# EAGLE schematic Magic CAN Node (EAGLE 5.12)
BOARDNAME: Magic CAN Node; BOM: EXCLUDE; DATABASE: ../../../Component libraries/partsdb.txt; PARTNO: 2206SA-10-46; RELEASE: RELEASE; REVISIONDATE: v2.1.0 - 2015-04-07

## Sheet 1 of 7
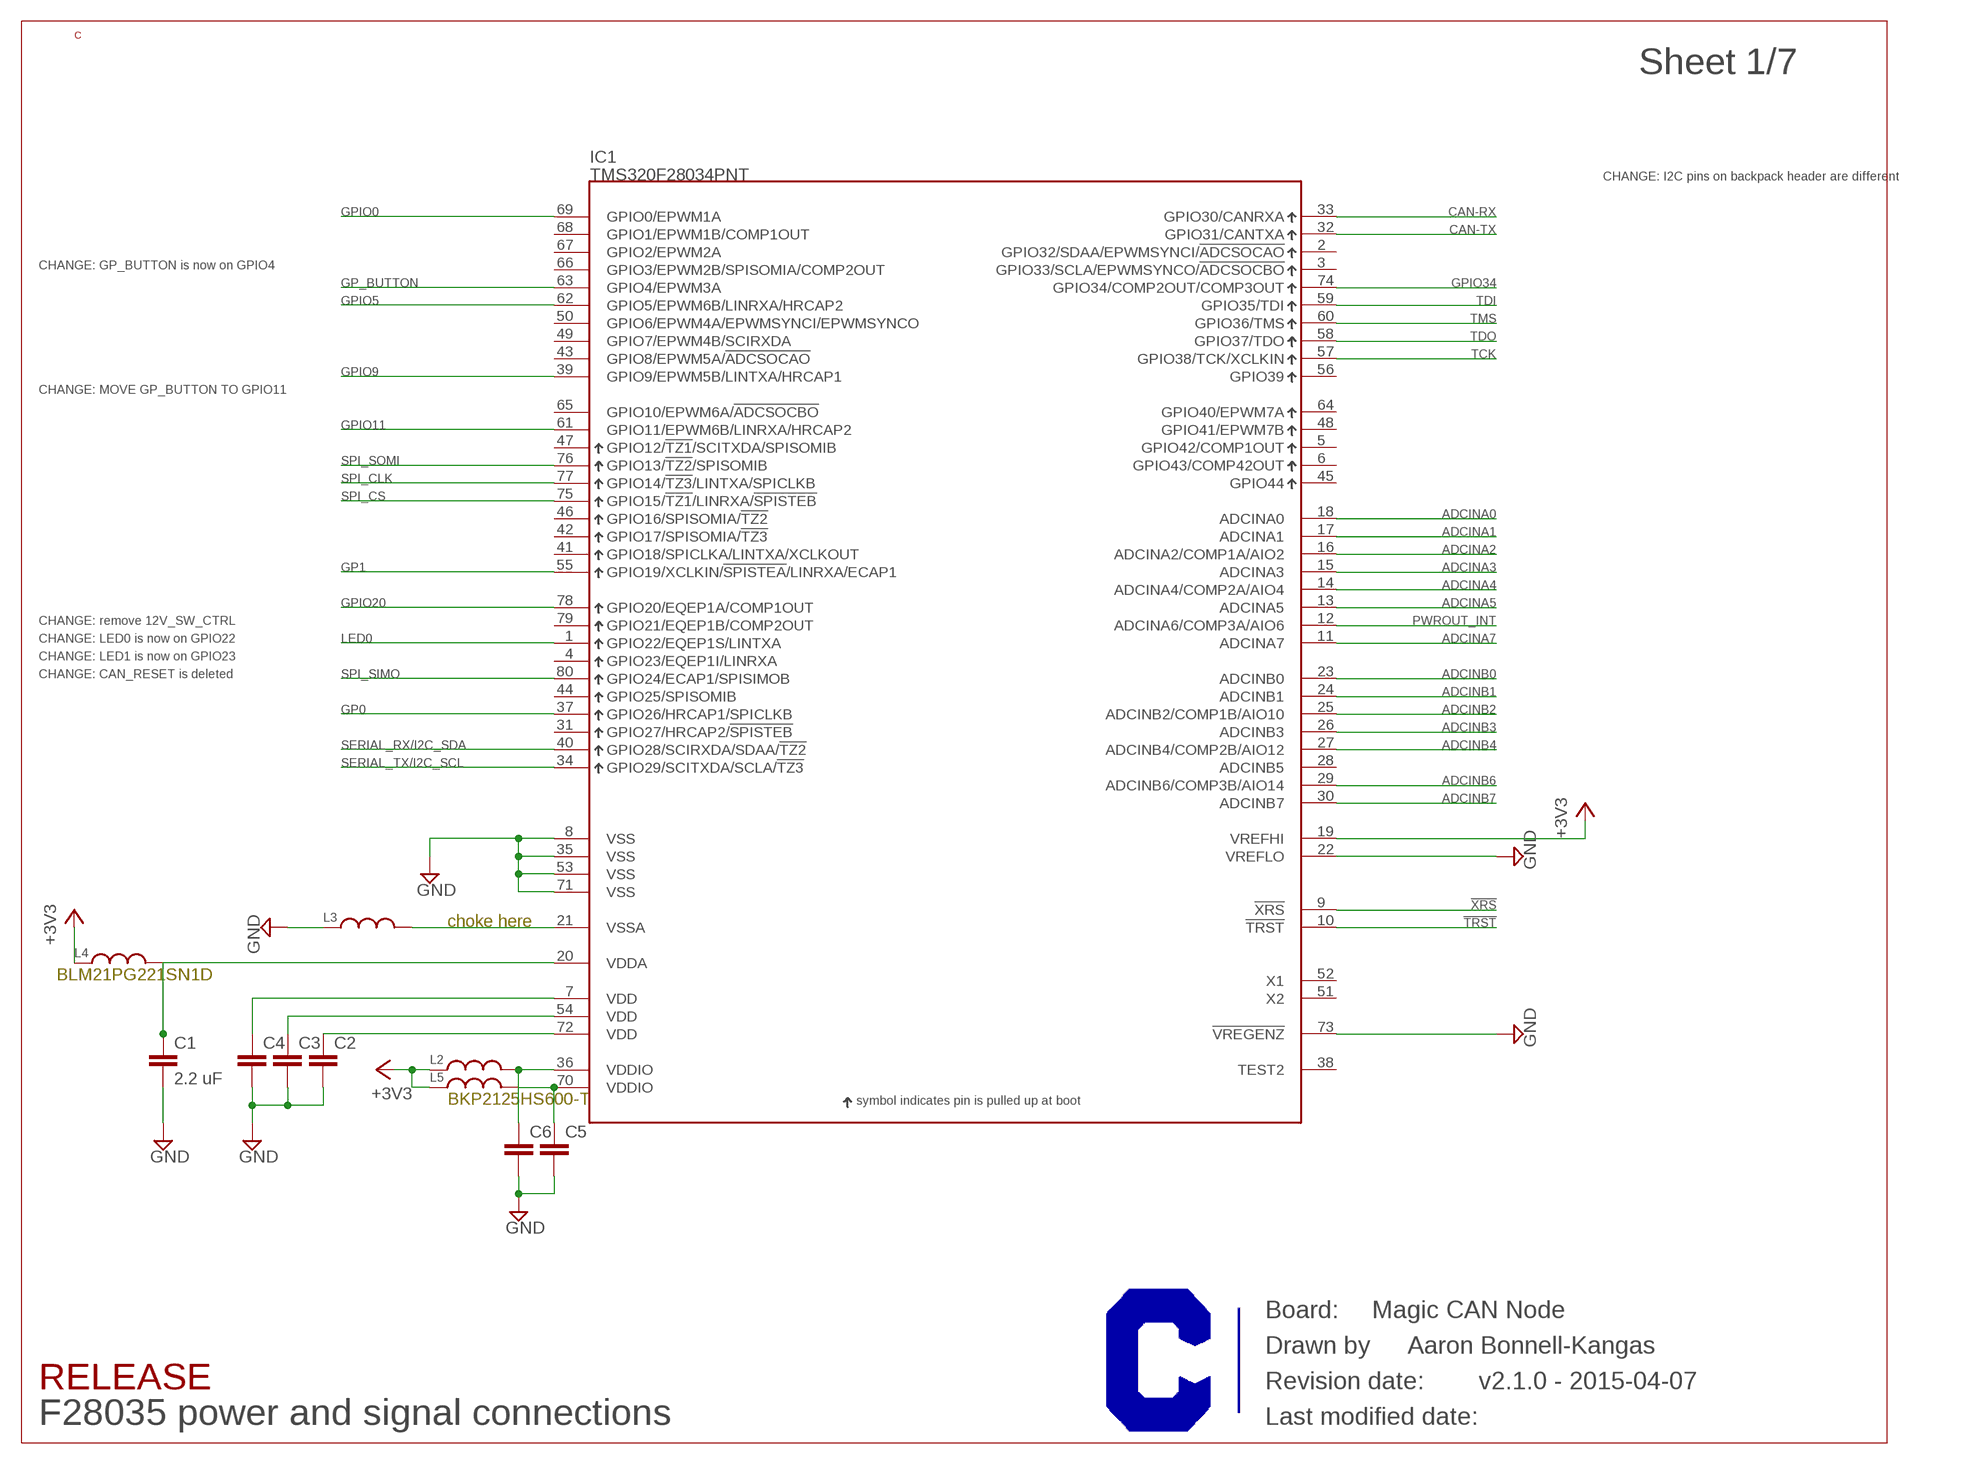
[diagram p0: schematic, sheet 1]

### Parts
C1  2.2 uF  C-EUC0603  [C0603]
C2  2.2 uF  C-EUC0603  [C0603]
C3  2.2 uF  C-EUC0603  [C0603]
C4  2.2 uF  C-EUC0603  [C0603]
C5  2.2 uF  C-EUC0603  [C0603]
C6  2.2 uF  C-EUC0603  [C0603]
IC1  TMS320F28034PNT  [PQFP-80_(S-PQFP-G80)]
L2  INDUCTOR  [0603]
L3  INDUCTOR  [0603]
L4  INDUCTOR  [0603]
L5  INDUCTOR  [0603]
U$2  CURRENT-C-LETTER-LANDSCAPE  [BLANK]
U$11  CURRENT-LOGO-0.25"  [CURRENT-0.25"]

### Nets
!TRST: IC1.10(!TRST) ; also sheet 2
!XRS: IC1.9(!XRS)
+3V3: IC1.19(VREFHI) L2.A L4.A L5.A ; also sheet 2,3,5,6,7
ADCINA0: IC1.18(ADCINA0) ; also sheet 6
ADCINA1: IC1.17(ADCINA1) ; also sheet 6
ADCINA2: IC1.16(ADCINA2/COMP1A/AIO2)
ADCINA3: IC1.15(ADCINA3) ; also sheet 6
ADCINA4: IC1.14(ADCINA4/COMP2A/AIO4) ; also sheet 6
ADCINA5: IC1.13(ADCINA5) ; also sheet 6
ADCINA7: IC1.11(ADCINA7) ; also sheet 6
ADCINB0: IC1.23(ADCINB0) ; also sheet 6
ADCINB1: IC1.24(ADCINB1) ; also sheet 6
ADCINB2: IC1.25(ADCINB2/COMP1B/AIO10) ; also sheet 6
ADCINB3: IC1.26(ADCINB3) ; also sheet 6
ADCINB4: IC1.27(ADCINB4/COMP2B/AIO12) ; also sheet 6
ADCINB6: IC1.29(ADCINB6/COMP3B/AIO14) ; also sheet 6
ADCINB7: IC1.30(ADCINB7) ; also sheet 7
CAN-RX: IC1.33(GPIO30/CANRXA) ; also sheet 4
CAN-TX: IC1.32(GPIO31/CANTXA) ; also sheet 4,5
GND: C1.2 C2.2 C3.2 C4.2 C5.2 C6.2 IC1.8(VSS) IC1.22(VREFLO) IC1.35(VSS) IC1.53(VSS) IC1.71(VSS) IC1.73(!VREGENZ) L3.A ; also sheet 2,3,4,5,6,7
GP0: IC1.37(GPIO26/HRCAP1/SPICLKB) ; also sheet 2
GP1: IC1.55(GPIO19/XCLKIN/!SPISTEA!/LINRXA/ECAP1) ; also sheet 2
GP_BUTTON: IC1.63(GPIO4/EPWM3A) ; also sheet 5
GPIO0: IC1.69(GPIO0/EPWM1A) ; also sheet 7
GPIO5: IC1.62(GPIO5/EPWM6B/LINRXA/HRCAP2) ; also sheet 7
GPIO9: IC1.39(GPIO9/EPWM5B/LINTXA/HRCAP1) ; also sheet 7
GPIO11: IC1.61(GPIO11/EPWM6B/LINRXA/HRCAP2) ; also sheet 7
GPIO20: IC1.78(GPIO20/EQEP1A/COMP1OUT) ; also sheet 7
GPIO34: IC1.74(GPIO34/COMP2OUT/COMP3OUT) ; also sheet 2
LED0: IC1.1(GPIO22/EQEP1S/LINTXA) ; also sheet 5
N$10: IC1.21(VSSA) L3.B
N$11: C6.1 IC1.36(VDDIO) L2.B
N$12: C5.1 IC1.70(VDDIO) L5.B
PWROUT_INT: IC1.12(ADCINA6/COMP3A/AIO6) ; also sheet 3
SERIAL_RX/I2C_SDA: IC1.40(GPIO28/SCIRXDA/SDAA/!TZ2) ; also sheet 7
SERIAL_TX/I2C_SCL: IC1.34(GPIO29/SCITXDA/SCLA/!TZ3) ; also sheet 7
SPI_CLK: IC1.77(GPIO14/!TZ3!/LINTXA/SPICLKB) ; also sheet 7
SPI_CS: IC1.75(GPIO15/!TZ1!/LINRXA/!SPISTEB) ; also sheet 7
SPI_SIMO: IC1.80(GPIO24/ECAP1/SPISIMOB) ; also sheet 7
SPI_SOMI: IC1.76(GPIO13/!TZ2!/SPISOMIB) ; also sheet 7
TCK: IC1.57(GPIO38/TCK/XCLKIN) ; also sheet 2
TDI: IC1.59(GPIO35/TDI) ; also sheet 2
TDO: IC1.58(GPIO37/TDO) ; also sheet 2
TMS: IC1.60(GPIO36/TMS) ; also sheet 2
VDD1: C2.1 IC1.72(VDD)
VDD2: C3.1 IC1.54(VDD)
VDD3: C4.1 IC1.7(VDD)
VDDA: C1.1 IC1.20(VDDA) L4.B
Unconnected: IC1.2(GPIO32/SDAA/EPWMSYNCI/!ADCSOCAO) IC1.3(GPIO33/SCLA/EPWMSYNCO/!ADCSOCBO) IC1.4(GPIO23/EQEP1I/LINRXA) IC1.5(GPIO42/COMP1OUT) IC1.6(GPIO43/COMP42OUT) IC1.28(ADCINB5) IC1.31(GPIO27/HRCAP2/!SPISTEB) IC1.38(TEST2) IC1.41(GPIO18/SPICLKA/LINTXA/XCLKOUT) IC1.42(GPIO17/SPISOMIA/!TZ3) IC1.43(GPIO8/EPWM5A/!ADCSOCAO) IC1.44(GPIO25/SPISOMIB) IC1.45(GPIO44) IC1.46(GPIO16/SPISOMIA/!TZ2) IC1.47(GPIO12/!TZ1!/SCITXDA/SPISOMIB) IC1.48(GPIO41/EPWM7B) IC1.49(GPIO7/EPWM4B/SCIRXDA) IC1.50(GPIO6/EPWM4A/EPWMSYNCI/EPWMSYNCO) IC1.51(X2) IC1.52(X1) IC1.56(GPIO39) IC1.64(GPIO40/EPWM7A) IC1.65(GPIO10/EPWM6A/!ADCSOCBO) IC1.66(GPIO3/EPWM2B/SPISOMIA/COMP2OUT) IC1.67(GPIO2/EPWM2A) IC1.68(GPIO1/EPWM1B/COMP1OUT) IC1.79(GPIO21/EQEP1B/COMP2OUT)

### Notes on the sheet
- CHANGE: I2C pins on backpack header are different
- CHANGE: GP_BUTTON is now on GPIO4
- CHANGE: MOVE GP_BUTTON TO GPIO11
- CHANGE: remove 12V_SW_CTRL
- CHANGE: LED0 is now on GPIO22
- CHANGE: LED1 is now on GPIO23
- CHANGE: CAN_RESET is deleted
- choke here
- BLM21PG221SN1D
- BKP2125HS600-T
- Aaron Bonnell-Kangas
- F28035 power and signal connections

## Sheet 2 of 7
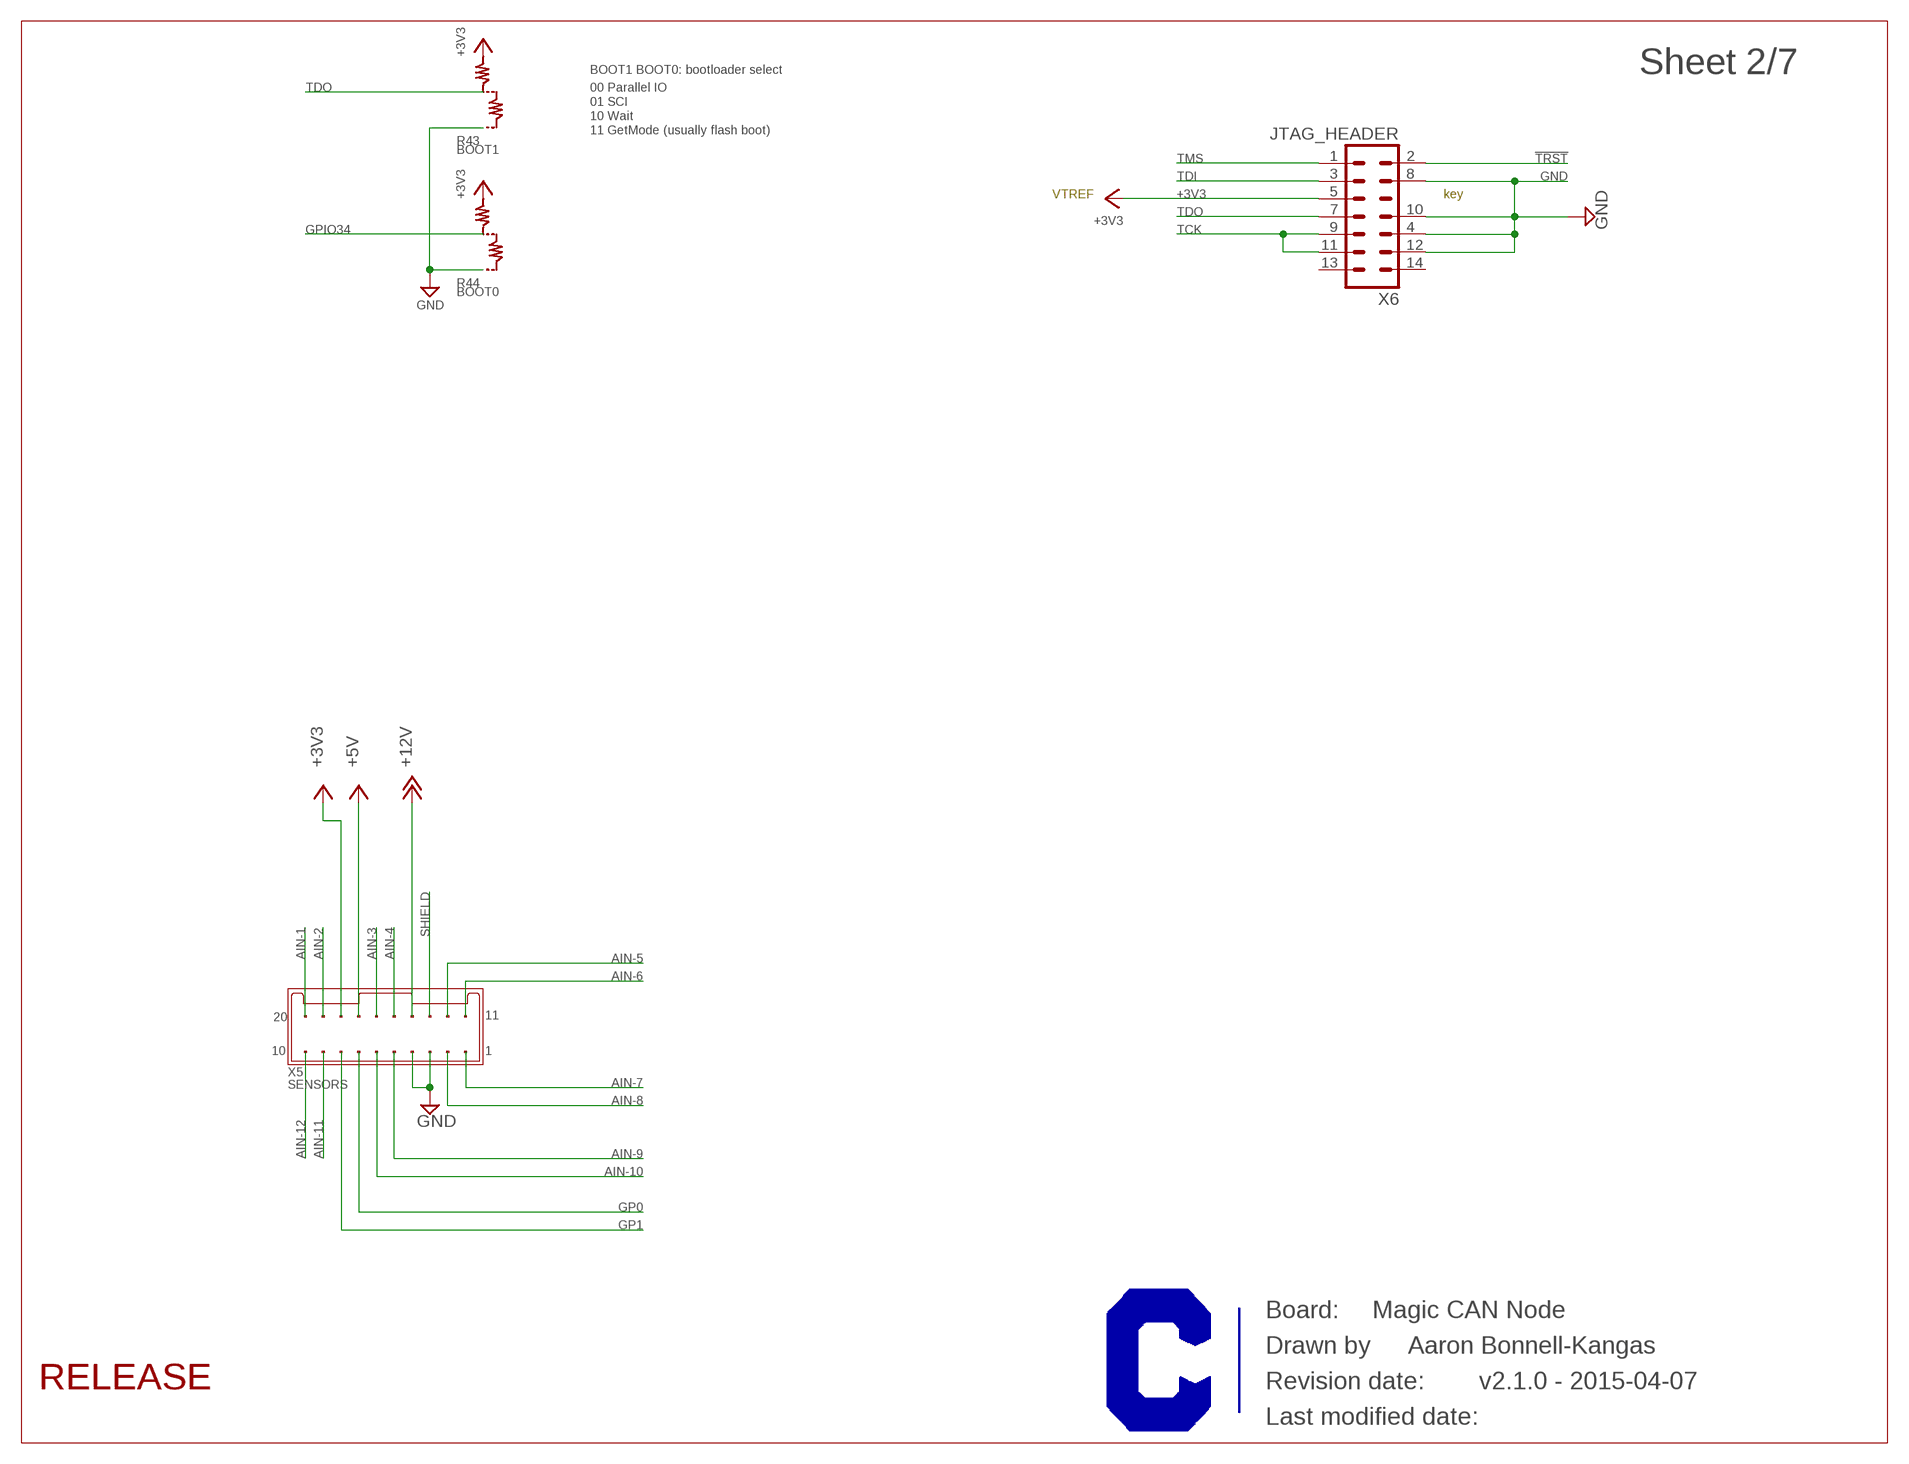
[diagram p1: schematic, sheet 2]

### Parts
R43  BOOT1  0402-JUMPER-3WAY-0603  [0603-JUMPER-3WAY]
R44  BOOT0  0402-JUMPER-3WAY-0603  [0603-JUMPER-3WAY]
U$3  CURRENT-C-LETTER-LANDSCAPE  [BLANK]
X5  SENSORS  MICROCLASP-20-DUAL-RA  [MICROCLASP-20-DUAL-RA]
X6  JTAG_HEADER  JTAG_HEADER-0.05"-SMT-VERT  [TI_JTAG_HEADER_0.05"_SMT]

### Nets
!TRST: X6.2(!TRST) ; also sheet 1
+3V3: R43.B R44.B X5.18 X6.5(VTREF) ; also sheet 1,3,5,6,7
+5V: X5.17 ; also sheet 3,4,7
+12V: X5.14 ; also sheet 3,4,5,7
AIN-1: X5.20 ; also sheet 6
AIN-2: X5.19 ; also sheet 6
AIN-3: X5.16 ; also sheet 6
AIN-4: X5.15 ; also sheet 6
AIN-5: X5.12 ; also sheet 6
AIN-6: X5.11 ; also sheet 6
AIN-7: X5.1 ; also sheet 6
AIN-8: X5.2 ; also sheet 6
AIN-9: X5.5 ; also sheet 6
AIN-10: X5.6 ; also sheet 6
AIN-11: X5.9 ; also sheet 6
AIN-12: X5.10 ; also sheet 6
GND: R43.C R44.C X5.3 X5.4 X6.4(GND) X6.8(GND) X6.10(GND) X6.12(GND) ; also sheet 1,3,4,5,6,7
GP0: X5.7 ; also sheet 1
GP1: X5.8 ; also sheet 1
GPIO34: R44.A ; also sheet 1
SHIELD: X5.13 ; also sheet 4,7
TCK: X6.9(TCK) X6.11 ; also sheet 1
TDI: X6.3(TDI) ; also sheet 1
TDO: R43.A X6.7(TDO) ; also sheet 1
TMS: X6.1(TMS) ; also sheet 1
Unconnected: X6.13(EMU0) X6.14(EMU1)

### Notes on the sheet
- BOOT1 BOOT0: bootloader select
- 00 Parallel IO
- 01 SCI
- 10 Wait
- 11 GetMode (usually flash boot)
- VTREF | key
- Aaron Bonnell-Kangas

## Sheet 3 of 7
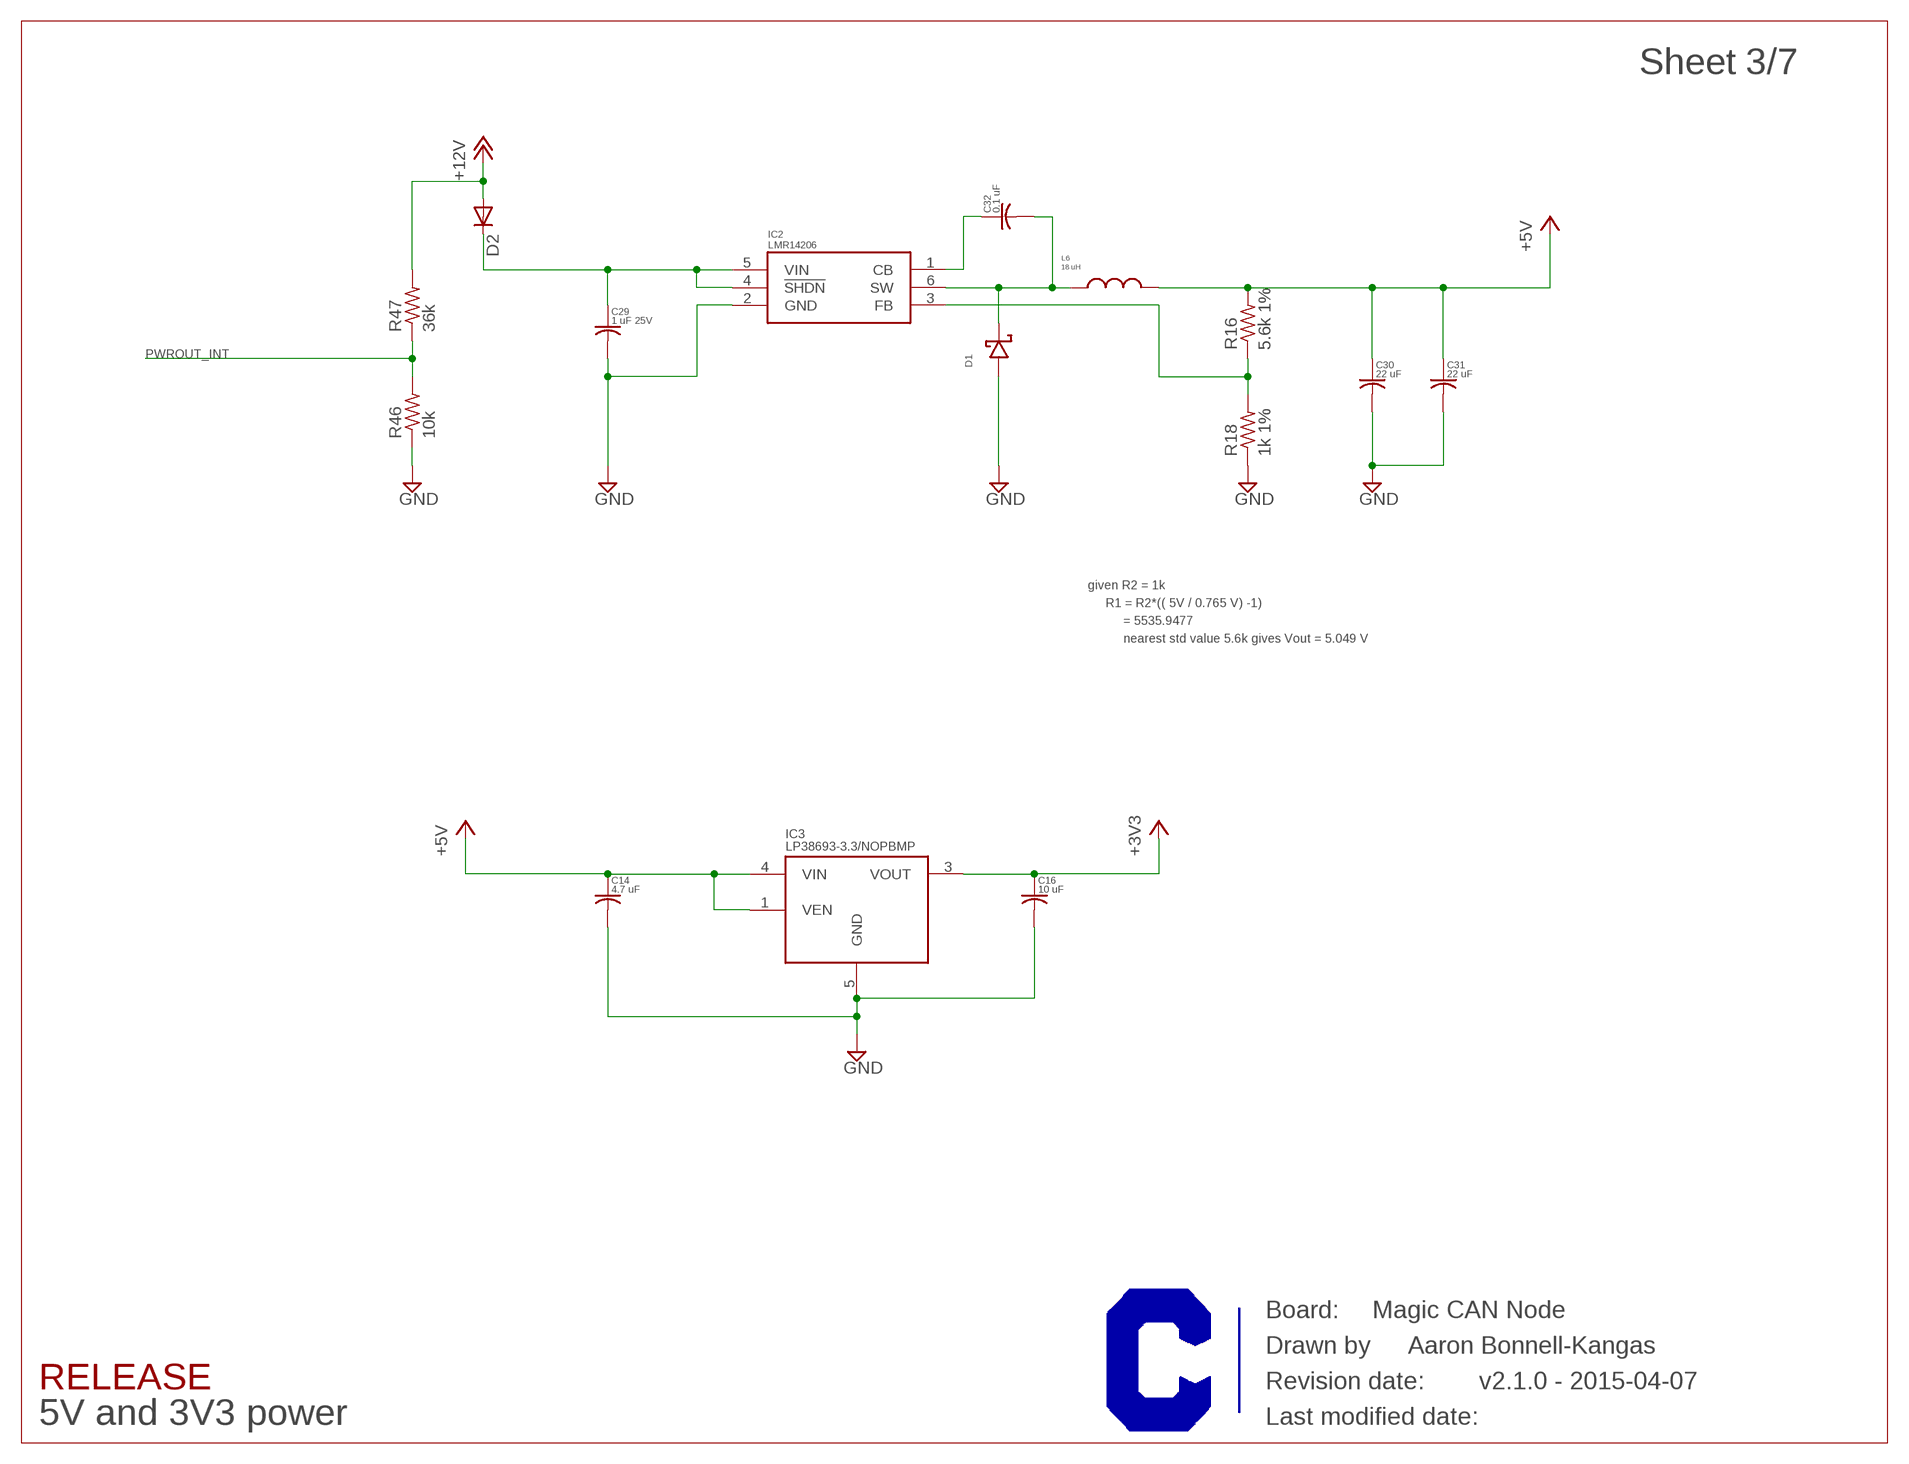
[diagram p2: schematic, sheet 3]

### Parts
C14  4.7 uF  C-USC1206  [C1206]
C16  10 uF  C-USC1206  [C1206]
C29  1 uF 25V  C-USC1206  [C1206]
C30  22 uF  C-USC0805  [C0805]
C31  22 uF  C-USC0805  [C0805]
C32  0.1 uF  C-USC0603  [C0603]
D1  SCHOTTKY_DIODE-SMA  [SMA]
D2  DIODE-SOD123  [SOD123]
IC2  LMR14206  [SOT-6_DDC]
IC3  LP38693-3.3/NOPBMP  [SOT-223-5]
L6  18 uH  VLP8040T  [VLP8040]
R16  5.6k 1%  R-US_R0603  [R0603]
R18  1k 1%  R-US_R0603  [R0603]
R46  10k  R-US_R0603  [R0603]
R47  36k  R-US_R0603  [R0603]
U$6  CURRENT-C-LETTER-LANDSCAPE  [BLANK]

### Nets
+3V3: C16.1 IC3.3(VOUT) ; also sheet 1,2,5,6,7
+5V: C14.1 C30.1 C31.1 IC3.1(VEN) IC3.4(VIN) L6.2 R16.2 ; also sheet 2,4,7
+12V: D2.A R47.2 ; also sheet 2,4,5,7
GND: C14.2 C16.2 C29.2 C30.2 C31.2 D1.ANODE IC2.2(GND) IC3.5(GND) R18.1 R46.1 ; also sheet 1,2,4,5,6,7
N$3: C32.2 D1.CATHODE IC2.6(SW) L6.1
N$7: C32.1 IC2.1(CB)
N$8: C29.1 D2.C IC2.4(!SHDN) IC2.5(VIN)
PWROUT_INT: R46.2 R47.1 ; also sheet 1
VSENSE1: IC2.3(FB) R16.1 R18.2

### Notes on the sheet
- given R2 = 1k
- R1 = R2*(( 5V / 0.765 V) -1)
- = 5535.9477
- nearest std value 5.6k gives Vout = 5.049 V
- Aaron Bonnell-Kangas
- 5V and 3V3 power

## Sheet 4 of 7
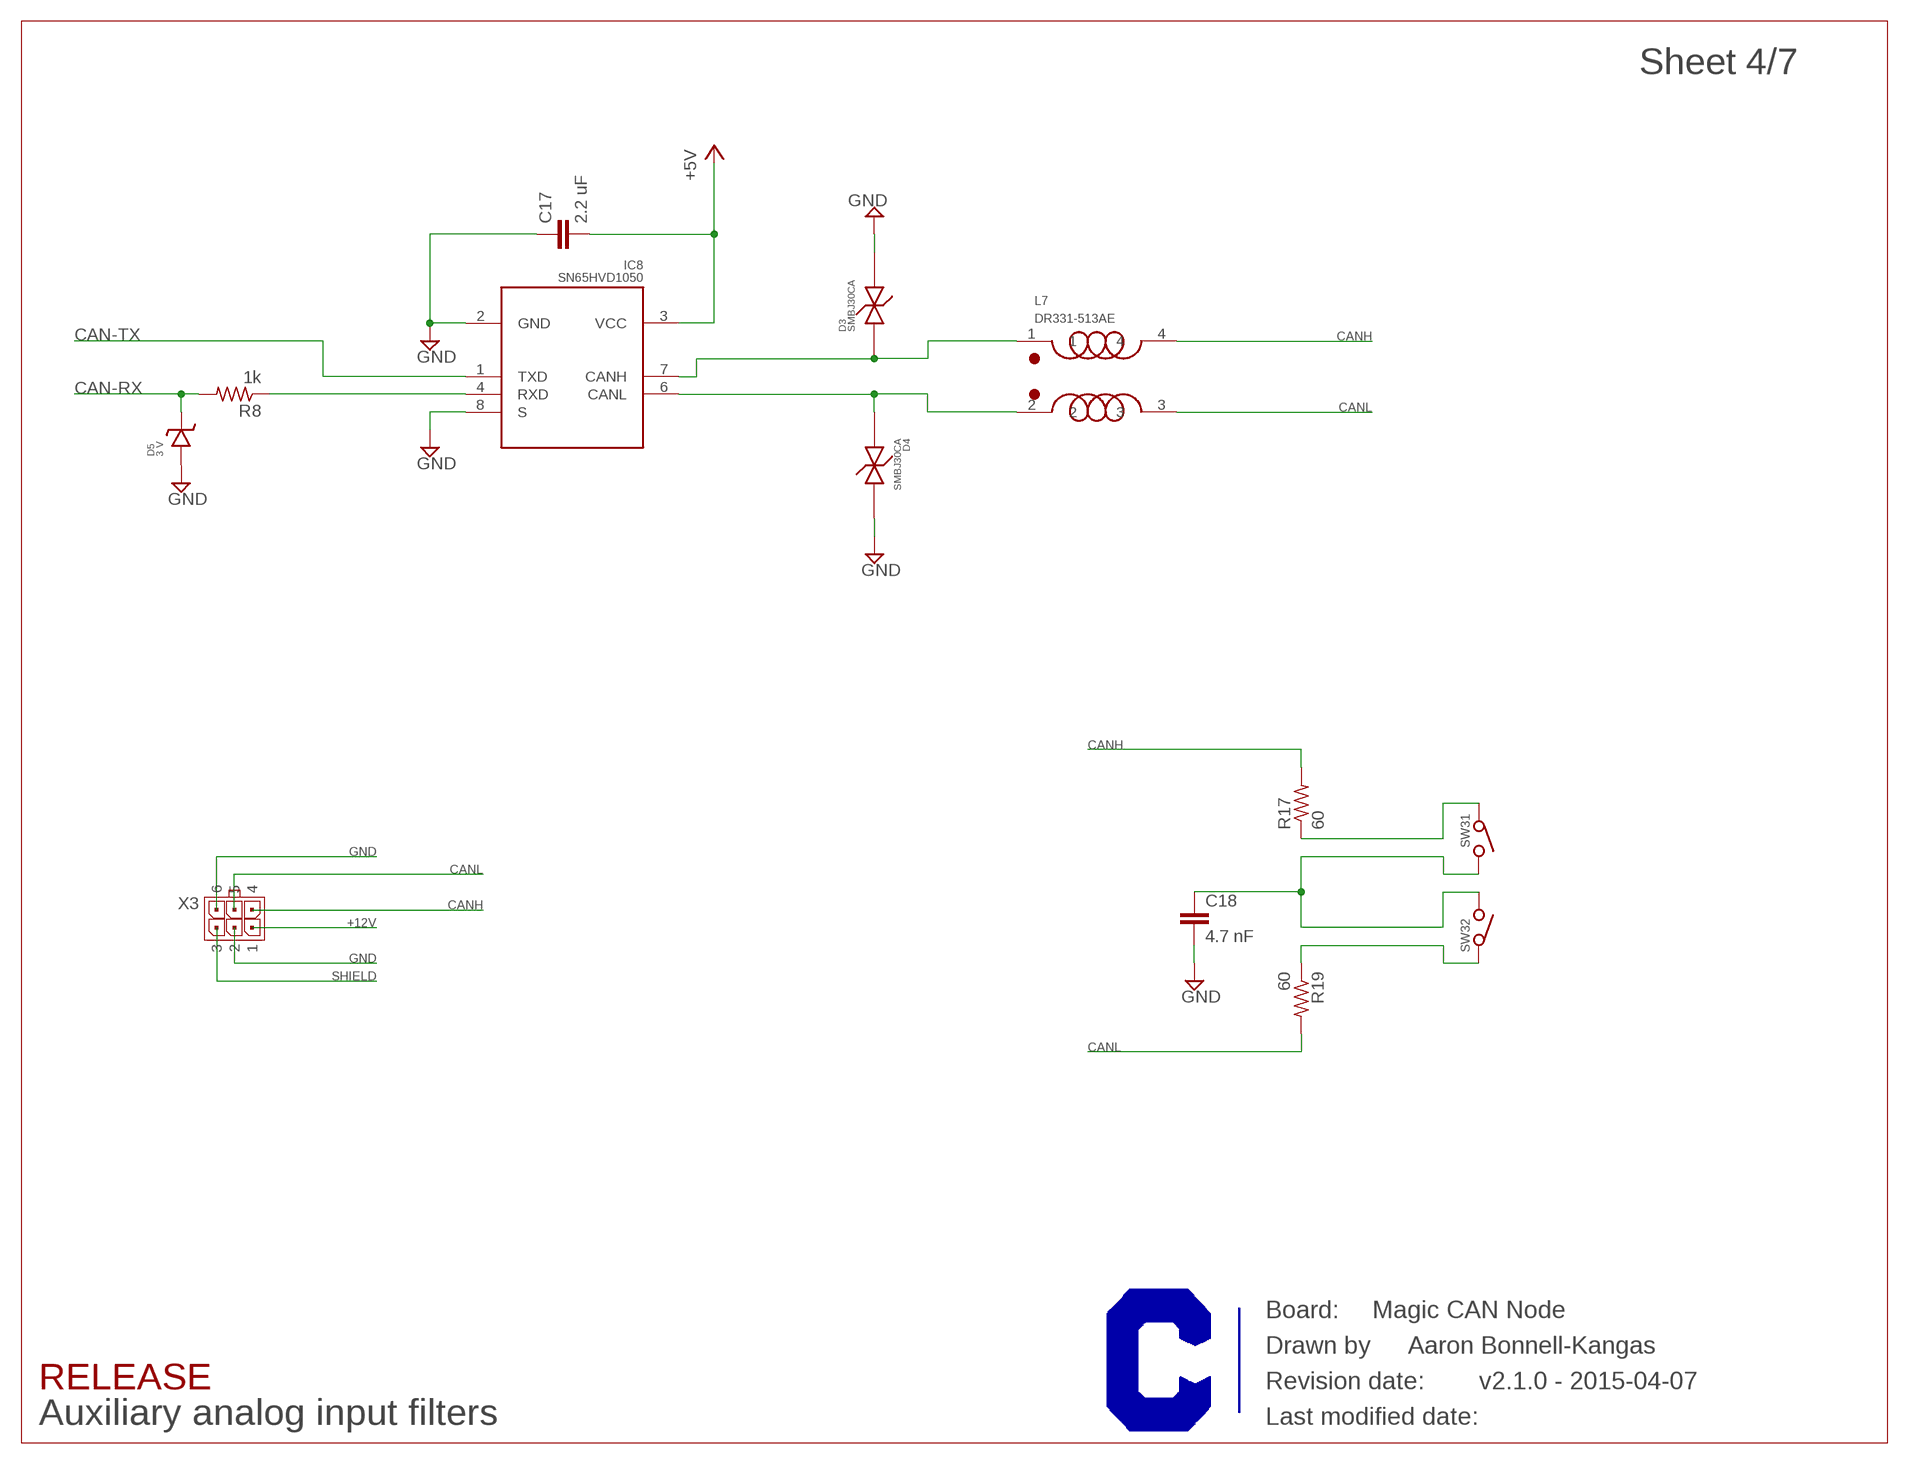
[diagram p3: schematic, sheet 4]

### Parts
C17  2.2 uF  C-EUC0603  [C0603]
C18  4.7 nF  C-EUC0603  [C0603]
D3  SMBJ30CA  [DO-214AA]
D4  SMBJ30CA  [DO-214AA]
D5  3 V  ZENER_DIODE-SOD-323  [SOD-323]
IC8  SN65HVD1050  [D_(R-PDSO-G8)]
L7  DR331-513AE  [SMD]
R8  1k  R-US_R0603  [R0603]
R17  60  R-US_R0603  [R0603]
R19  60  R-US_R0603  [R0603]
SW3  218-2_GULLWING  [218-2_GULLWING]
U$9  CURRENT-C-LETTER-LANDSCAPE  [BLANK]
X3  MICROFIT-06-DUAL-RA-SMD  [MICROFIT-6-DUAL-RA-SMD]

### Nets
+5V: C17.2 IC8.3(VCC) ; also sheet 2,3,7
+12V: X3.1 ; also sheet 2,3,5,7
CAN-RX: D5.CATHODE R8.2 ; also sheet 1
CAN-TX: IC8.1(TXD) ; also sheet 1,5
CANH: L7.4 R17.2 X3.4
CANL: L7.3 R19.2 X3.5
GND: C17.1 C18.2 D3.2 D4.2 D5.ANODE IC8.2(GND) IC8.8(S) X3.2 X3.6 ; also sheet 1,2,3,5,6,7
N$20: D4.1 IC8.6(CANL) L7.2
N$21: D3.1 IC8.7(CANH) L7.1
N$22: R19.1 SW3.2A
N$23: R17.1 SW3.1A
N$24: C18.1 SW3.1B SW3.2B
N$26: IC8.4(RXD) R8.1
SHIELD: X3.3 ; also sheet 2,7

### Notes on the sheet
- Aaron Bonnell-Kangas
- Auxiliary analog input filters

## Sheet 5 of 7
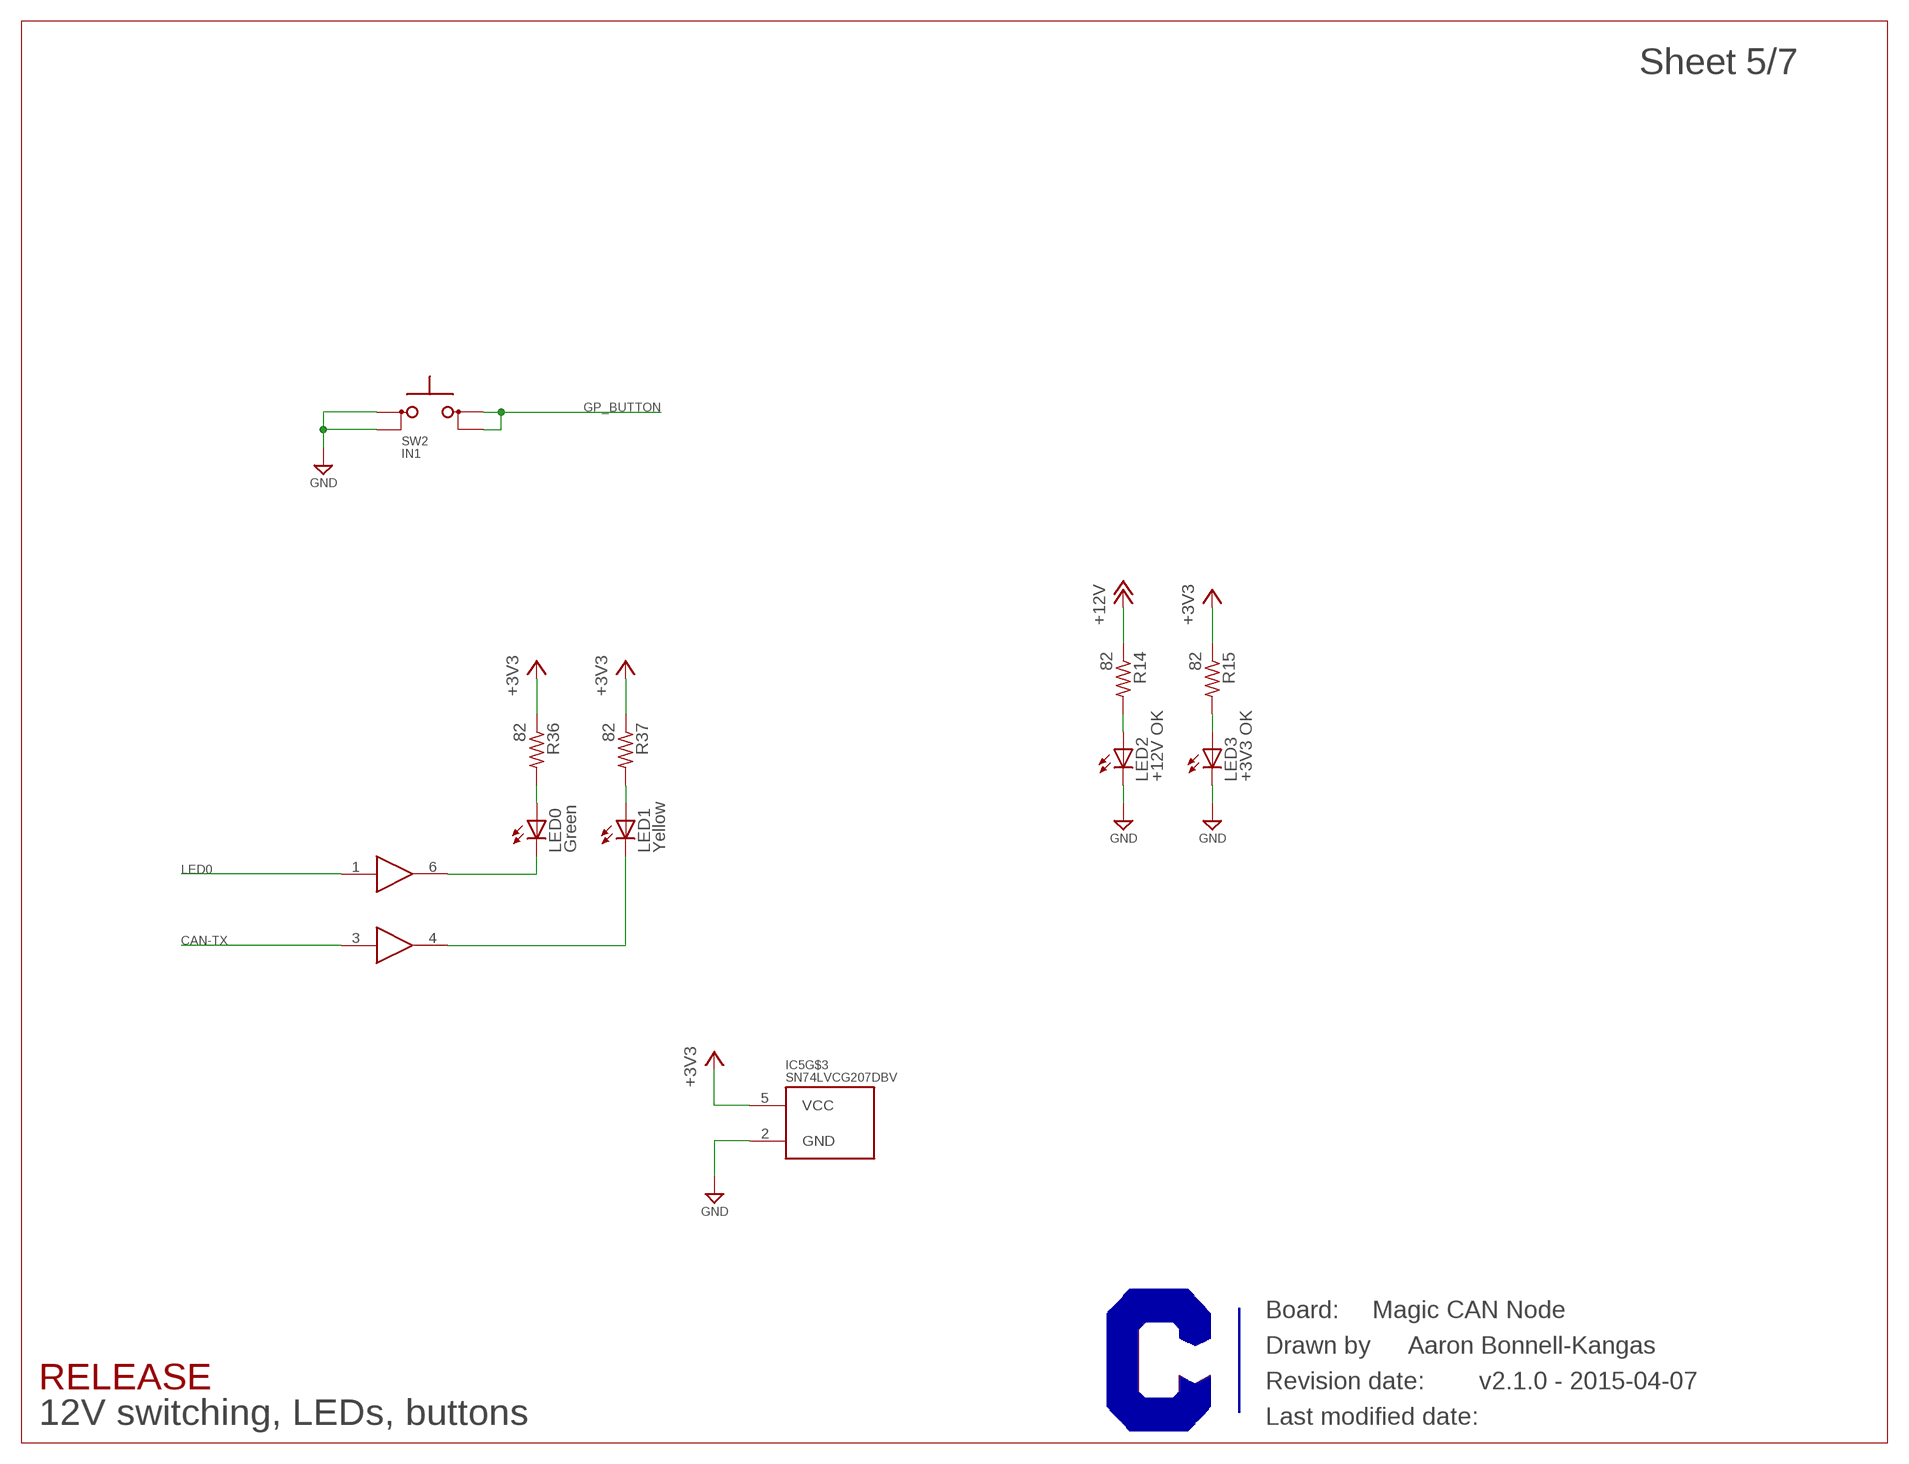
[diagram p4: schematic, sheet 5]

### Parts
IC5  SN74LVCG207DBV  [DBV_(R-PDSO-G6)]
LED0  Green  LEDCHIP-LED0603  [CHIP-LED0603]
LED1  Yellow  LEDCHIP-LED0603  [CHIP-LED0603]
LED2  +12V OK  LEDCHIP-LED0603  [CHIP-LED0603]
LED3  +3V3 OK  LEDCHIP-LED0603  [CHIP-LED0603]
R14  82  R-US_R0805  [R0805]
R15  82  R-US_R0805  [R0805]
R36  82  R-US_R0805  [R0805]
R37  82  R-US_R0805  [R0805]
SW2  IN1  MC32884  [MC32884]
U$1  CURRENT-C-LETTER-LANDSCAPE  [BLANK]

### Nets
+3V3: IC5.5(VCC) R15.1 R36.1 R37.1 ; also sheet 1,2,3,6,7
+12V: R14.1 ; also sheet 2,3,4,7
CAN-TX: IC5.3(A) ; also sheet 1,4
GND: IC5.2(GND) LED2.C LED3.C SW2.A@1(A) SW2.A@2(A) ; also sheet 1,2,3,4,6,7
GP_BUTTON: SW2.B@1(B) SW2.B@2(B) ; also sheet 1
LED0: IC5.1(A) ; also sheet 1
N$1: LED2.A R14.2
N$2: LED3.A R15.2
N$37: IC5.6(Y) LED0.C
N$38: IC5.4(Y) LED1.C
N$39: LED0.A R36.2
N$40: LED1.A R37.2

### Notes on the sheet
- Aaron Bonnell-Kangas
- 12V switching, LEDs, buttons

## Sheet 6 of 7
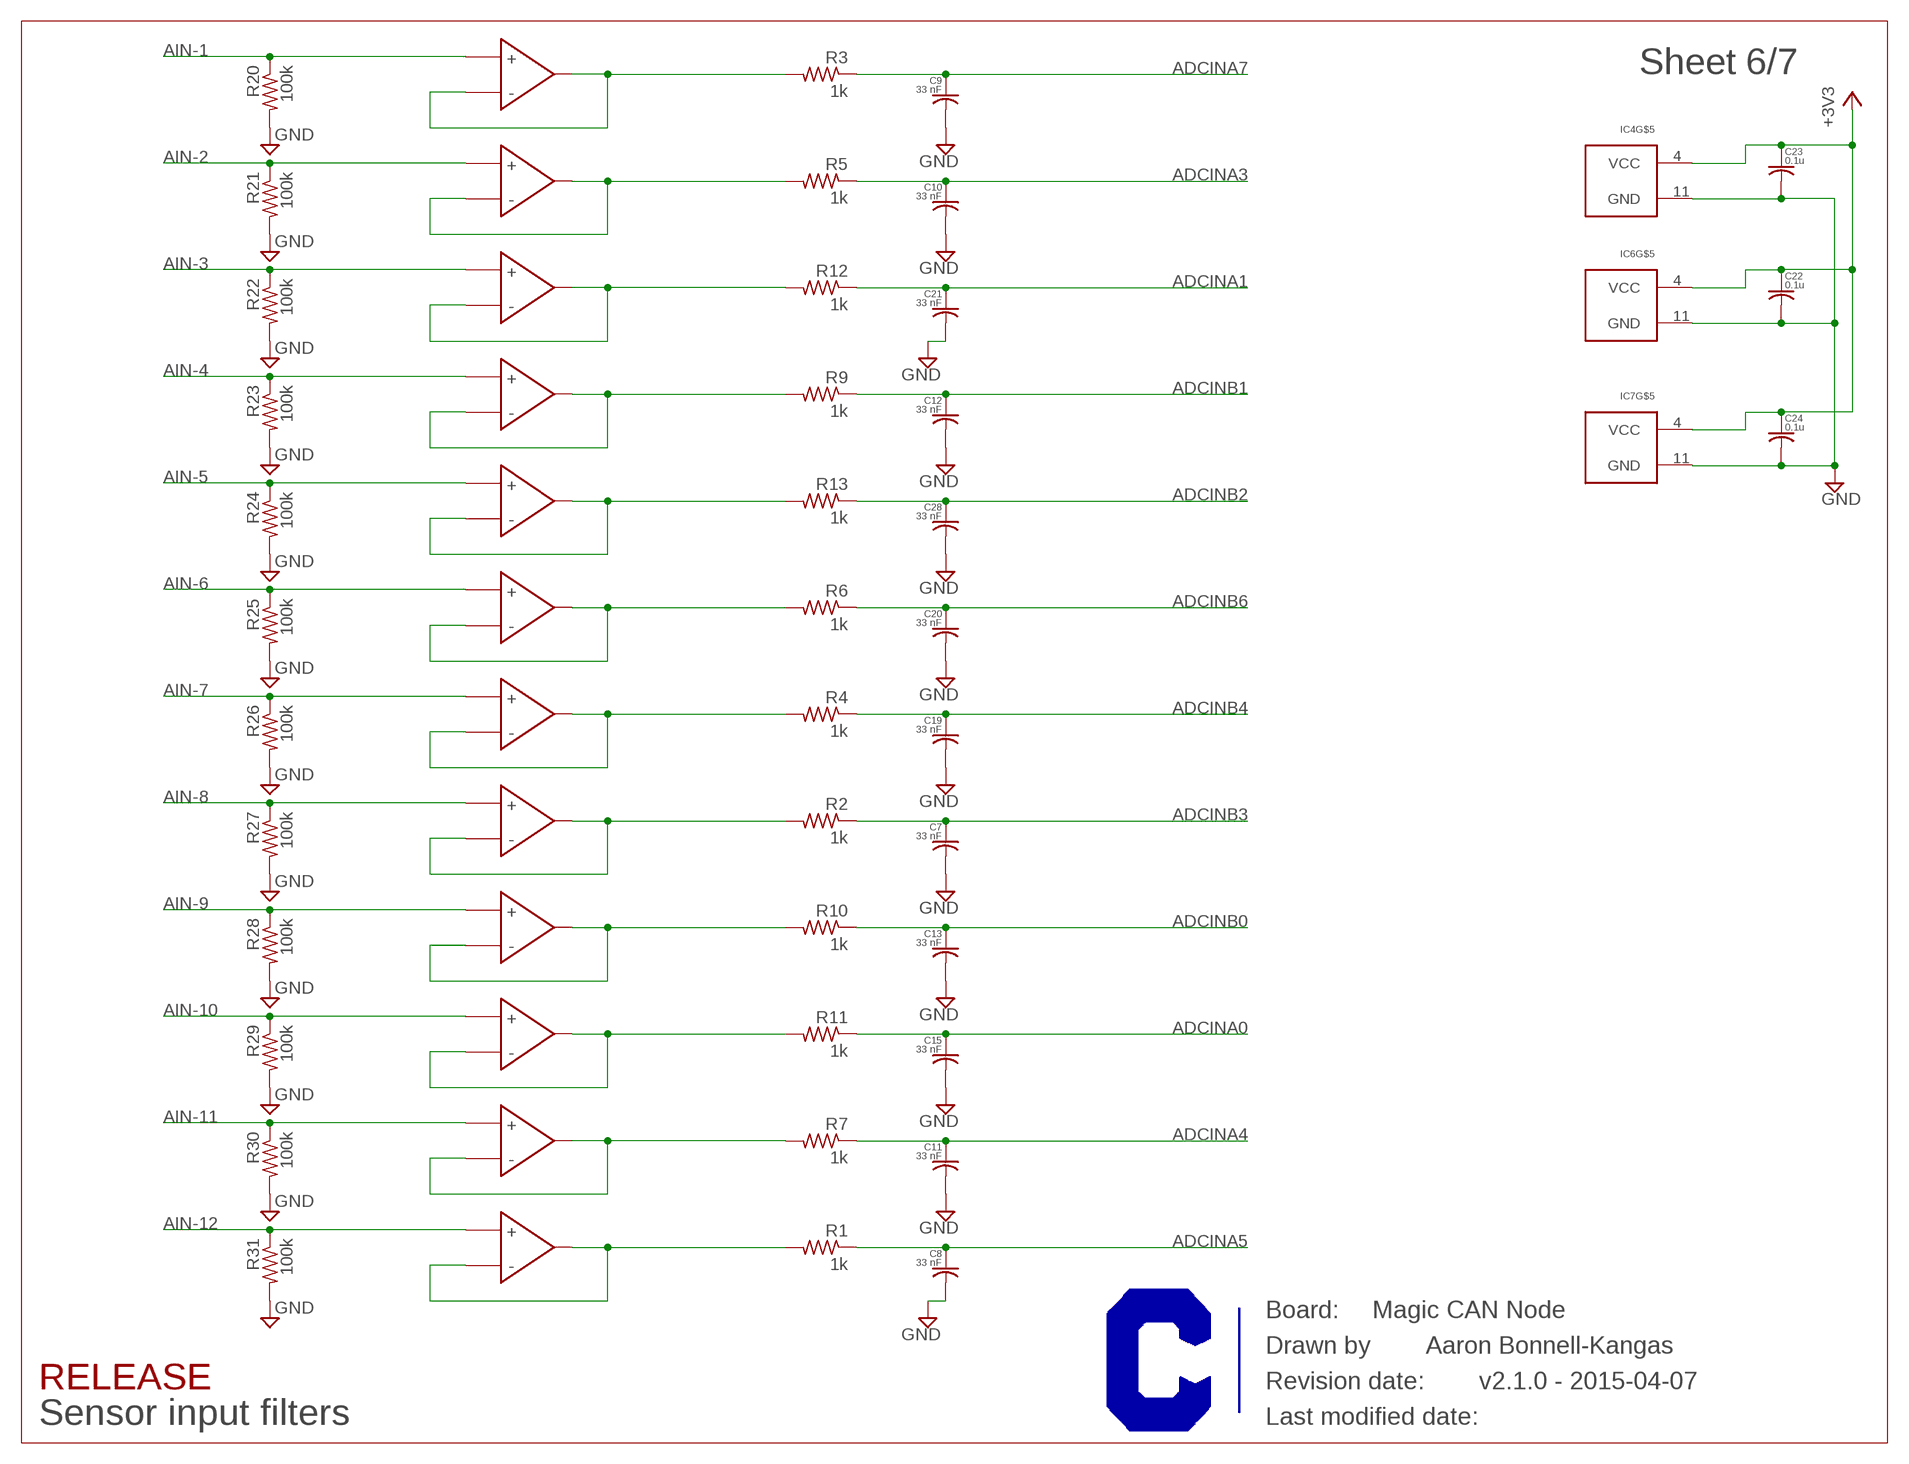
[diagram p5: schematic, sheet 6]

### Parts
C7  33 nF  C-USC0603  [C0603]
C8  33 nF  C-USC0603  [C0603]
C9  33 nF  C-USC0603  [C0603]
C10  33 nF  C-USC0603  [C0603]
C11  33 nF  C-USC0603  [C0603]
C12  33 nF  C-USC0603  [C0603]
C13  33 nF  C-USC0603  [C0603]
C15  33 nF  C-USC0603  [C0603]
C19  33 nF  C-USC0603  [C0603]
C20  33 nF  C-USC0603  [C0603]
C21  33 nF  C-USC0603  [C0603]
C22  0.1u  C-USC0603  [C0603]
C23  0.1u  C-USC0603  [C0603]
C24  0.1u  C-USC0603  [C0603]
C28  33 nF  C-USC0603  [C0603]
IC4  TLV2764IPWR  [PW_(R-PDSO-G14)_(TSSOP-14)]
IC6  TLV2764IPWR  [PW_(R-PDSO-G14)_(TSSOP-14)]
IC7  TLV2764IPWR  [PW_(R-PDSO-G14)_(TSSOP-14)]
R1  1k  R-US_R0603  [R0603]
R2  1k  R-US_R0603  [R0603]
R3  1k  R-US_R0603  [R0603]
R4  1k  R-US_R0603  [R0603]
R5  1k  R-US_R0603  [R0603]
R6  1k  R-US_R0603  [R0603]
R7  1k  R-US_R0603  [R0603]
R9  1k  R-US_R0603  [R0603]
R10  1k  R-US_R0603  [R0603]
R11  1k  R-US_R0603  [R0603]
R12  1k  R-US_R0603  [R0603]
R13  1k  R-US_R0603  [R0603]
R20  100k  R-US_R0402  [R0402]
R21  100k  R-US_R0402  [R0402]
R22  100k  R-US_R0402  [R0402]
R23  100k  R-US_R0402  [R0402]
R24  100k  R-US_R0402  [R0402]
R25  100k  R-US_R0402  [R0402]
R26  100k  R-US_R0402  [R0402]
R27  100k  R-US_R0402  [R0402]
R28  100k  R-US_R0402  [R0402]
R29  100k  R-US_R0402  [R0402]
R30  100k  R-US_R0402  [R0402]
R31  100k  R-US_R0402  [R0402]
U$7  CURRENT-C-LETTER-LANDSCAPE  [BLANK]

### Nets
+3V3: C22.1 C23.1 C24.1 IC4.4(VCC) IC6.4(VCC) IC7.4(VCC) ; also sheet 1,2,3,5,7
ADCINA0: C15.1 R11.1 ; also sheet 1
ADCINA1: C21.1 R12.1 ; also sheet 1
ADCINA3: C10.1 R5.1 ; also sheet 1
ADCINA4: C11.1 R7.1 ; also sheet 1
ADCINA5: C8.1 R1.1 ; also sheet 1
ADCINA7: C9.1 R3.1 ; also sheet 1
ADCINB0: C13.1 R10.1 ; also sheet 1
ADCINB1: C12.1 R9.1 ; also sheet 1
ADCINB2: C28.1 R13.1 ; also sheet 1
ADCINB3: C7.1 R2.1 ; also sheet 1
ADCINB4: C19.1 R4.1 ; also sheet 1
ADCINB6: C20.1 R6.1 ; also sheet 1
AIN-1: IC4.3(IN+) R20.1 ; also sheet 2
AIN-2: IC4.12(IN+) R21.1 ; also sheet 2
AIN-3: IC6.3(IN+) R22.1 ; also sheet 2
AIN-4: IC6.12(IN+) R23.1 ; also sheet 2
AIN-5: IC7.3(IN+) R24.1 ; also sheet 2
AIN-6: IC7.12(IN+) R25.1 ; also sheet 2
AIN-7: IC7.10(IN+) R26.1 ; also sheet 2
AIN-8: IC7.5(IN+) R27.1 ; also sheet 2
AIN-9: IC6.10(IN+) R28.1 ; also sheet 2
AIN-10: IC6.5(IN+) R29.1 ; also sheet 2
AIN-11: IC4.10(IN+) R30.1 ; also sheet 2
AIN-12: IC4.5(IN+) R31.1 ; also sheet 2
GND: C7.2 C8.2 C9.2 C10.2 C11.2 C12.2 C13.2 C15.2 C19.2 C20.2 C21.2 C22.2 C23.2 C24.2 C28.2 IC4.11(GND) IC6.11(GND) IC7.11(GND) R20.2 R21.2 R22.2 R23.2 R24.2 R25.2 R26.2 R27.2 R28.2 R29.2 R30.2 R31.2 ; also sheet 1,2,3,4,5,7
N$4: IC4.6(IN-) IC4.7(OUT) R1.2
N$5: IC4.8(OUT) IC4.9(IN-) R7.2
N$6: IC6.13(IN-) IC6.14(OUT) R9.2
N$9: IC6.1(OUT) IC6.2(IN-) R12.2
N$13: IC4.1(OUT) IC4.2(IN-) R3.2
N$14: IC4.13(IN-) IC4.14(OUT) R5.2
N$15: IC7.1(OUT) IC7.2(IN-) R13.2
N$16: IC7.6(IN-) IC7.7(OUT) R2.2
N$17: IC6.8(OUT) IC6.9(IN-) R10.2
N$18: IC6.6(IN-) IC6.7(OUT) R11.2
N$19: IC7.8(OUT) IC7.9(IN-) R4.2
N$25: IC7.13(IN-) IC7.14(OUT) R6.2

### Notes on the sheet
- Aaron Bonnell-Kangas
- Sensor input filters

## Sheet 7 of 7
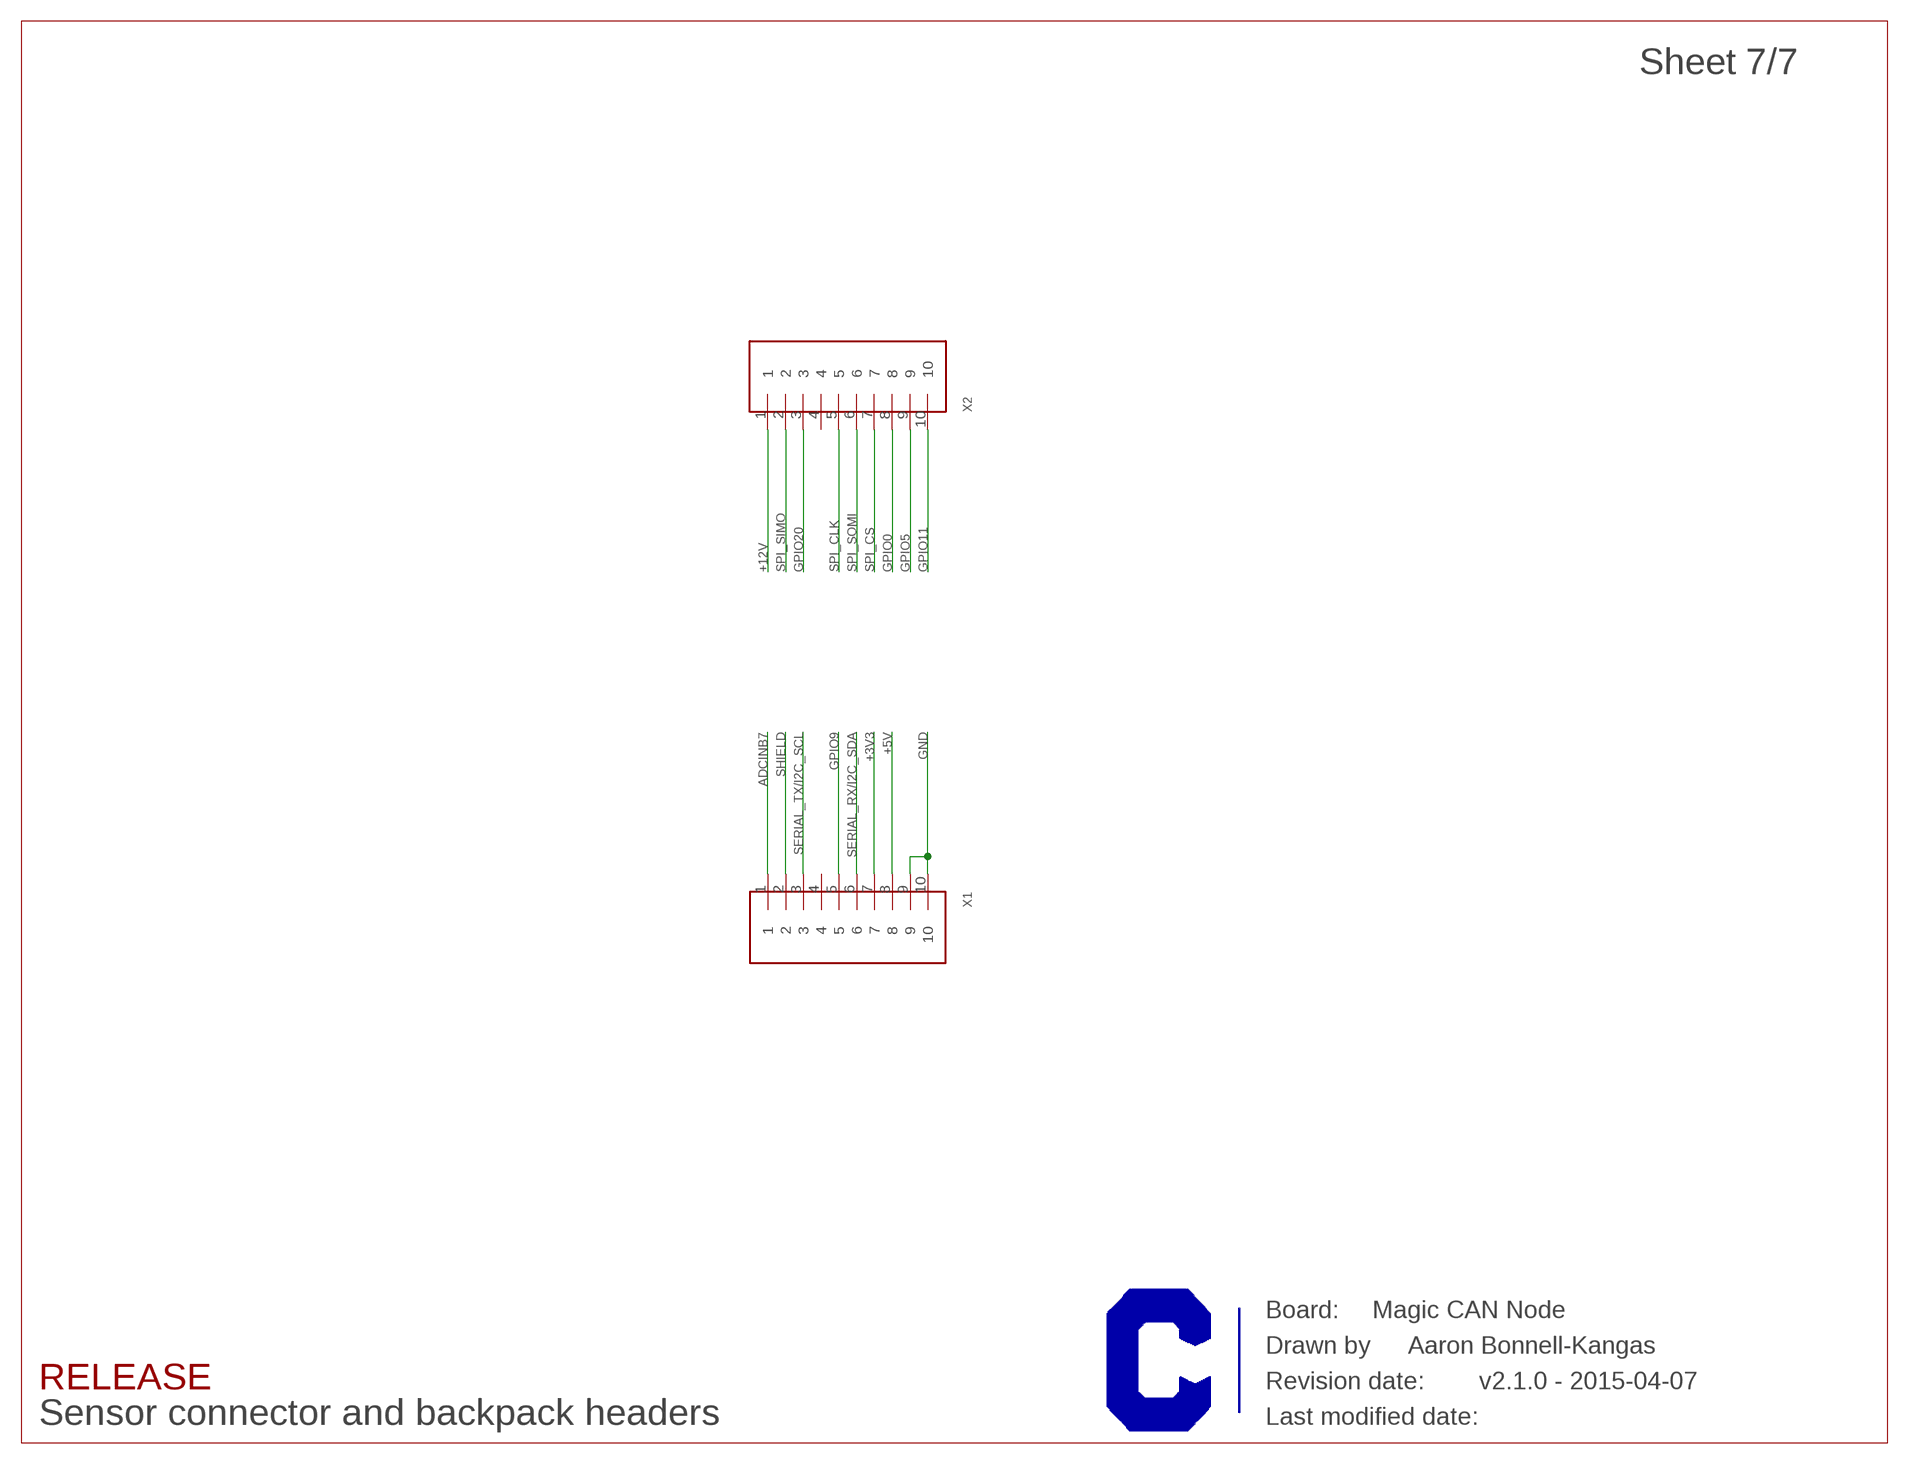
[diagram p6: schematic, sheet 7]

### Parts
U$8  CURRENT-C-LETTER-LANDSCAPE  [BLANK]
X1  MALE-1X10-0.05"-PCB-VERT  [MA0.05"-1X10]
X2  MALE-1X10-0.05"-PCB-VERT  [MA0.05"-1X10]

### Nets
+3V3: X1.7 ; also sheet 1,2,3,5,6
+5V: X1.8 ; also sheet 2,3,4
+12V: X2.1 ; also sheet 2,3,4,5
ADCINB7: X1.1 ; also sheet 1
GND: X1.9 X1.10 ; also sheet 1,2,3,4,5,6
GPIO0: X2.8 ; also sheet 1
GPIO5: X2.9 ; also sheet 1
GPIO9: X1.5 ; also sheet 1
GPIO11: X2.10 ; also sheet 1
GPIO20: X2.3 ; also sheet 1
SERIAL_RX/I2C_SDA: X1.6 ; also sheet 1
SERIAL_TX/I2C_SCL: X1.3 ; also sheet 1
SHIELD: X1.2 ; also sheet 2,4
SPI_CLK: X2.5 ; also sheet 1
SPI_CS: X2.7 ; also sheet 1
SPI_SIMO: X2.2 ; also sheet 1
SPI_SOMI: X2.6 ; also sheet 1
Unconnected: X1.4 X2.4

### Notes on the sheet
- Aaron Bonnell-Kangas
- Sensor connector and backpack headers

## Library data of the parts
C1-C6 C17 C18 = rcl:C-EU: CAPACITOR, European symbol
C7-C16 C19-C24 C28-C32 = rcl:C-US: CAPACITOR, American symbol
D1 = Diodes:SCHOTTKY_DIODE
D2 = diode:DIODE-: DIODE
D3 D4 = Littelfuse:SMBJ30CA: Bidirectional TVS Zener Diode 30V Breakdown http://www.digikey.com/product-detail/en/SMBJ30CA/SMBJ30CALFCT-ND/286112; PARTNO: SMBJ30CALFCT-ND
D5 = Diodes:ZENER_DIODE
IC1 = TI:TMS320F28034: TMS320F2803x (Piccolo) 32-Bit High-Efficiency MCU Datasheet: http://www.ti.com/lit/ds/sprs584j/sprs584j.pdf Product page: http://www.ti.com/product/tms320f28034; PARTNO: TMS320F28035PNT
IC2 = TI:LMR14206: LMR14206 SIMPLE SWITCHER® 42Vin, 0.6A Step-Down Voltage Regulator in SOT-23 Datasheet: http://www.ti.com/lit/ds/symlink/lmr14206.pdf
IC3 = TI:LP38693: TI LP38693-3.3 LDO 500mA Very Low Vdo. http://www.ti.com/lit/ds/symlink/lp38693.pdf; PARTNO: LP38693MP-3.3/NOPB
IC4 IC6 IC7 = TI:TLV2764: TLV2764 - Micropower, Rail-to-Rail Input/Output Op-Amps with Shutdown Datasheet: http://www.ti.com/lit/ds/symlink/tlv2764.pdf; PARTNO: TLV2764IPWR
IC5 = TI:SN74LVCG207: SN74LVC2G07: Dual Buffer/Driver with Open Drain Outputs no datasheet 4 u!!
IC8 = TI:SN65HVD1050: SN65HVD1050 - EMC Optimized CAN Transceiever Datasheet: http://www.ti.com/lit/ds/symlink/sn65hvd1050.pdf; PARTNO: SN65HVD1050D
L2-L5 = Passives:INDUCTOR
L6 = TDK:VLP: VLP Series Shielded Wound Ferrite Inductors Datasheet: http://datasheet.octopart.com/VLP8040T-100M-TDK-datasheet-16646286.pdf
L7 = Bourns:DR331-513AE: Bourns Common Mode Choke; PARTNO: DR331-513AECT-ND
LED0 LED1-LED3 = led:LED: LED OSRAM: - CHIPLED LG R971, LG N971, LY N971, LG Q971, LY Q971, LO R971, LY R971 LH N974, LH R974 LS Q976, LO Q976, LY Q976 LO Q996 - Hyper CHIPLED LW Q18S LB Q993, LB Q99A, LB R99A - SideLED LS A670, LO A670, LY A670, LG A670, LP A670 LB A673, LV A673, LT A673, LW A673 LH A674 LY A675 LS A676, LA A676, LO A676, LY A676, LW A676 LS A679, LY A679, LG A679 - Hyper Micro SIDELED® LS Y876, LA Y876, LO Y876, LY Y876 LT Y87S - SmartLED LW L88C, LW L88S LB L89C, LB L89S, LG L890 LS L89K, LO L89K, LY L89K LS L896, LA L896, LO L896, LY L896 - TOPLED LS T670, LO T670, LY T670, LG T670, LP T670 LSG T670, LSP T670, LSY T670, LOP T670, LYG T670 LG T671, LOG T671, LSG T671 LB T673, LV T673, LT T673, LW T673 LH T674 LS T676, LA T676, LO T676, LY T676, LB T676, LH T676, LSB T676, LW T676 LB T67C, LV T67C, LT T67C, LS T67K, LO T67K, LY T67K, LW E67C LS E67B, LA E67B, LO E67B, LY E67B, LB E67C, LV E67C, LT E67C LW T67C LS T679, LY T679, LG T679 LS T770, LO T770, LY T770, LG T770, LP T770 LB T773, LV T773, LT T773, LW T773 LH T774 LS E675, LA E675, LY E675, LS T675 LS T776, LA T776, LO T776, LY T776, LB T776 LHGB T686 LT T68C, LB T68C - Hyper Mini TOPLED® LB M676 - Mini TOPLED Santana® LG M470 LS M47K, LO M47K, LY M47K Source: http://www.osram.convergy.de LUXEON: - LUMILED® LXK2-PW12-R00, LXK2-PW12-S00, LXK2-PW14-U00, LXK2-PW14-V00 LXK2-PM12-R00, LXK2-PM12-S00, LXK2-PM14-U00 LXK2-PE12-Q00, LXK2-PE12-R00, LXK2-PE12-S00, LXK2-PE14-T00, LXK2-PE14-U00 LXK2-PB12-K00, LXK2-PB12-L00, LXK2-PB12-M00, LXK2-PB14-N00, LXK2-PB14-P00, LXK2-PB14-Q00 LXK2-PR12-L00, LXK2-PR12-M00, LXK2-PR14-Q00, LXK2-PR14-R00 LXK2-PD12-Q00, LXK2-PD12-R00, LXK2-PD12-S00 LXK2-PH12-R00, LXK2-PH12-S00 LXK2-PL12-P00, LXK2-PL12-Q00, LXK2-PL12-R00 Source: www.luxeon.com KINGBRIGHT: KA-3528ASYC Source: www.kingbright.com
R1-R13 R16-R31 R46 R47 = rcl:R-US_: RESISTOR, American symbol
R14 R15 R36 R37 = resistor:R-US_: RESISTOR, American symbol
R43 R44 = Passives:0402-JUMPER-3WAY: A 3-way solder jumper in 0402 size.
SW2 = Multicomp:MC32884: Multicomp MC32884 tactile switch Actually Multicomp isn't an OEM apparently? They're just a Farnell/Newark/Element14 house brand, buying up other mfg's components, rebranding the datasheets, and then reselling them. Interesting, huh? Anyway, datasheet: http://www.newark.com/pdfs/datasheets/spc/Ta-1143.pdf Newark page: http://www.newark.com/jsp/search/productdetail.jsp?SKU=67P3663
SW3 = CTS:218-2: CTS 218-2: 0.05" pitch DIP switch, SPST, 2 positions; PARTNO: 218-2LPST
U$1-U$3 U$6-U$9 = Frames:CURRENT-C-LETTER-LANDSCAPE; BOM: EXCLUDE
U$11 = Logos:CURRENT-LOGO; BOM: EXCLUDE
X1 X2 = Pin headers:MALE-1X10: Male pin header, 1 row, 10 pins; PARTNO: BD020-10-A-J-0350-0300-L-G
X3 = Molex:MICROFIT-06-DUAL: Molex MicroFit 3.00mm Pitch Header, Surface Mount, Dual Row, 6 Circuits Note, November 2014: These come in three styles: Through-hole, with metal clip retention to PCB (not currently represented) (cheapest) SMD, with solder tab retention (-SMD) (more expensive, commonly stocked) SMD, with metal clip retention (-SMD-CLIP_RETENTION) (most expensive, not often stocked) Please use them in that order! Drawing: http://www.molex.com/pdm_docs/sd/430450609_sd.pdf (right-angle) Information: http://www.molex.com/molex/products/datasheet.jsp?part=active/0430450618_PCB_HEADERS.xml; PARTNO: 43045-0609
X5 = Molex-Aaron:MICROCLASP-20-DUAL
X6 = TI:JTAG_HEADER: TI 14-pin JTAG header Reference: http://processors.wiki.ti.com/index.php/JTAG_Connectors; PARTNO: FTS-107-01-F-DV